# EAGLE design uv5rAdaptor (EAGLE 6.2)
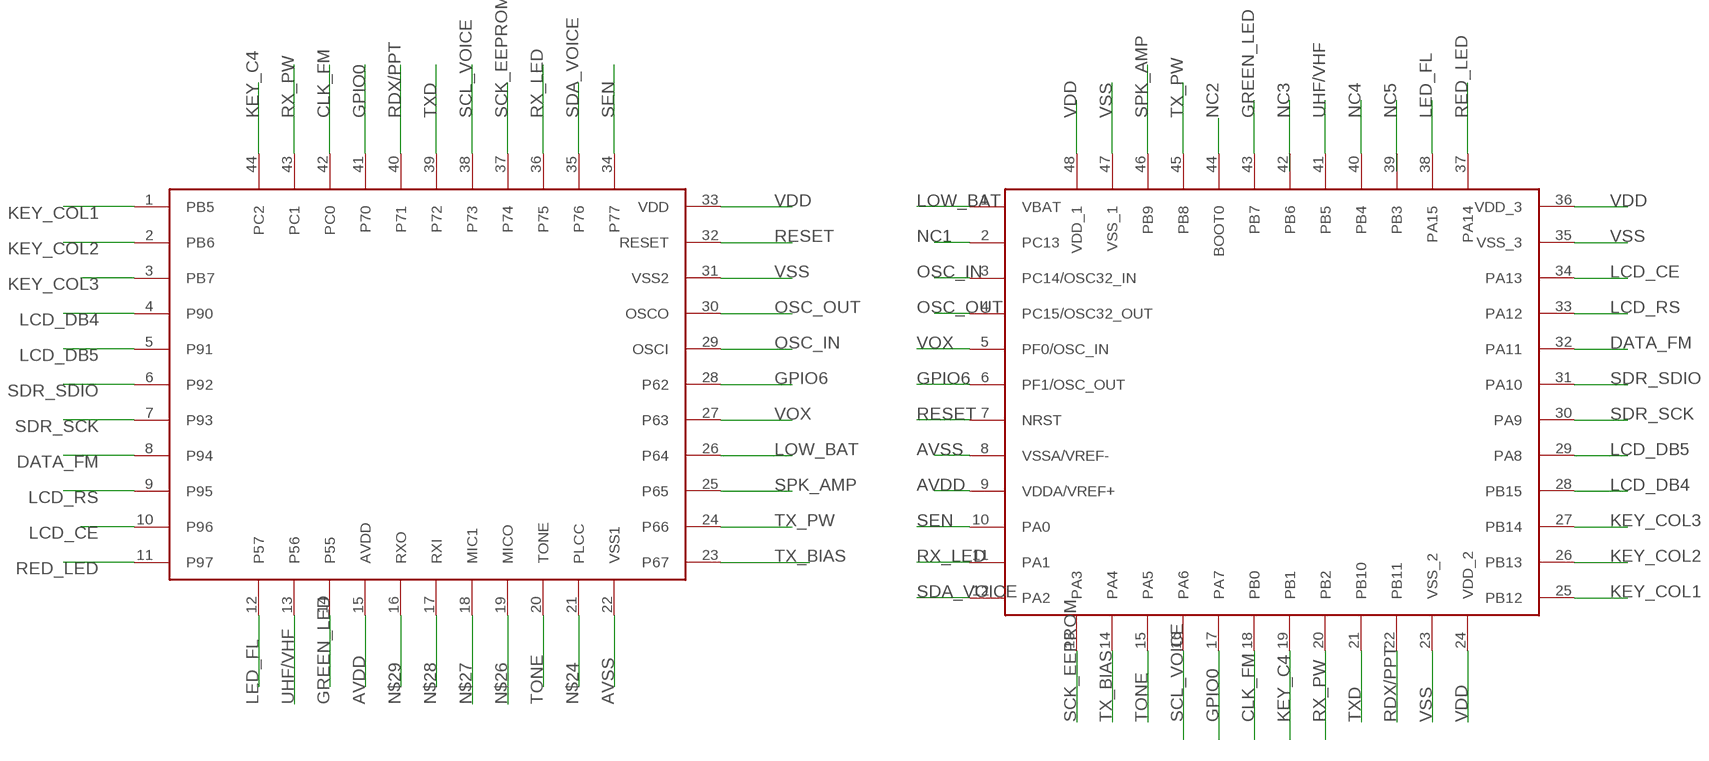
[diagram p0: schematic, sheet 1]

## Parts
U$1  STM32F302XX/STM32F303XX  [LQFP48]
U$2  UV5R  [TQFP44]

## Nets
AVDD: U$1.9(VDDA/VREF+) U$2.15(AVDD)
AVSS: U$1.8(VSSA/VREF-) U$2.22(VSS1)
CLK_FM: U$1.18(PB0) U$2.42(PC0)
DATA_FM: U$1.32(PA11) U$2.8(P94)
GPIO0: U$1.17(PA7) U$2.41(P70)
GPIO6: U$1.6(PF1/OSC_OUT) U$2.28(P62)
GREEN_LED: U$1.43(PB7) U$2.14(P55)
KEY_C4: U$1.19(PB1) U$2.44(PC2)
KEY_COL1: U$1.25(PB12) U$2.1(PB5)
KEY_COL2: U$1.26(PB13) U$2.2(PB6)
KEY_COL3: U$1.27(PB14) U$2.3(PB7)
LCD_CE: U$1.34(PA13) U$2.10(P96)
LCD_DB4: U$1.28(PB15) U$2.4(P90)
LCD_DB5: U$1.29(PA8) U$2.5(P91)
LCD_RS: U$1.33(PA12) U$2.9(P95)
LED_FL: U$1.38(PA15) U$2.12(P57)
LOW_BAT: U$1.1(VBAT) U$2.26(P64)
N$24: U$2.21(PLCC)
N$26: U$2.19(MICO)
N$27: U$2.18(MIC1)
N$28: U$2.17(RXI)
N$29: U$2.16(RXO)
NC1: U$1.2(PC13)
NC2: U$1.44(BOOT0)
NC4: U$1.40(PB4)
OSC_IN: U$1.3(PC14/OSC32_IN) U$2.29(OSCI)
OSC_OUT: U$1.4(PC15/OSC32_OUT) U$2.30(OSCO)
RDX/PPT: U$1.22(PB11) U$2.40(P71)
RED_LED: U$1.37(PA14) U$2.11(P97)
RESET: U$1.7(NRST) U$2.32(RESET)
RX_LED: U$1.11(PA1) U$2.36(P75)
RX_PW: U$1.20(PB2) U$2.43(PC1)
SCK_EEPROM: U$1.13(PA3) U$2.37(P74)
SCL_VOICE: U$1.16(PA6) U$2.38(P73)
SDA_VOICE: U$1.12(PA2) U$2.35(P76)
SDR_SCK: U$1.30(PA9) U$2.7(P93)
SDR_SDIO: U$1.31(PA10) U$2.6(P92)
SEN: U$1.10(PA0) U$2.34(P77)
SPK_AMP: U$1.46(PB9) U$2.25(P65)
TONE: U$1.15(PA5) U$2.20(TONE)
TX_BIAS: U$1.14(PA4) U$2.23(P67)
TX_PW: U$1.45(PB8) U$2.24(P66)
TXD: U$1.21(PB10) U$2.39(P72)
UHF/VHF: U$1.41(PB5) U$2.13(P56)
VDD: U$1.24(VDD_2) U$1.36(VDD_3) U$1.48(VDD_1) U$2.33(VDD)
VOX: U$1.5(PF0/OSC_IN) U$2.27(P63)
VSS: U$1.23(VSS_2) U$1.35(VSS_3) U$1.47(VSS_1) U$2.31(VSS2)
Unconnected: U$1.39(PB3) U$1.42(PB6)

## Library data of the parts
U$1 = Stm:STM32F302XX/STM32F303XX
U$2 = Stm:UV5R

## Board
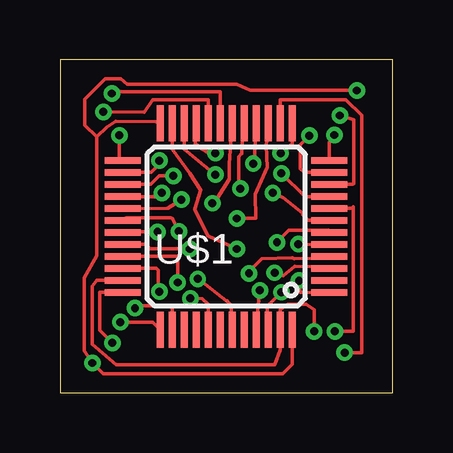
[diagram p1: board, top side]
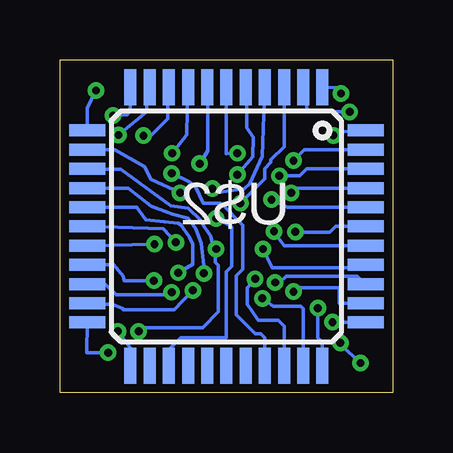
[diagram p2: board, bottom side, seen from below]

Size 13.87 x 13.87 mm. Coordinates in mm from the lower left corner, seen from the top.
Outline: 0,0 13.87,0 13.87,13.87 0,13.87 0,0
Copper layers (1*16): Top 0.0356mm / dielectric 1.5011mm / Bottom 0.0356mm
Design rules: minimum track width 6mil, minimum drill 13mil, track to track 6mil, track to pad 6mil, pad to pad 6mil, via to via 6mil, smd to smd 6mil, copper to edge 15mil, drill to drill 6mil, minimum pad ring 7mil, minimum via ring 7mil, stop-mask expansion 4mil, vias tented up to drill 0mil, thermal gap 10mil

### Footprints (pad centres in the part's own frame; a part is rotated, then mirrored left to right if it is on the bottom)
LQFP48 = smd 1.5 x 0.28: 1 -4.3,2.75; 2 -4.3,2.25; 3 -4.3,1.75; 4 -4.3,1.25; 5 -4.3,0.75; 6 -4.3,0.25; 7 -4.3,-0.25; 8 -4.3,-0.75; 9 -4.3,-1.25; 10 -4.3,-1.75; 11 -4.3,-2.25; 12 -4.3,-2.75; 25 4.3,-2.75; 26 4.3,-2.25; 27 4.3,-1.75; 28 4.3,-1.25; 29 4.3,-0.75; 30 4.3,-0.25; 31 4.3,0.25; 32 4.3,0.75; 33 4.3,1.25; 34 4.3,1.75; 35 4.3,2.25; 36 4.3,2.75 | smd 0.28 x 1.5: 13 -2.75,-4.3; 14 -2.25,-4.3; 15 -1.75,-4.3; 16 -1.25,-4.3; 17 -0.75,-4.3; 18 -0.25,-4.3; 19 0.25,-4.3; 20 0.75,-4.3; 21 1.25,-4.3; 22 1.75,-4.3; 23 2.25,-4.3; 24 2.75,-4.3; 37 2.75,4.3; 38 2.25,4.3; 39 1.75,4.3; 40 1.25,4.3; 41 0.75,4.3; 42 0.25,4.3; 43 -0.25,4.3; 44 -0.75,4.3; 45 -1.25,4.3; 46 -1.75,4.3; 47 -2.25,4.3; 48 -2.75,4.3
TQFP44 = smd 1.5 x 0.5 bottom: 1 -5.8,4; 2 -5.8,3.2; 3 -5.8,2.4; 4 -5.8,1.6; 5 -5.8,0.8; 6 -5.8,0; 7 -5.8,-0.8; 8 -5.8,-1.6; 9 -5.8,-2.4; 10 -5.8,-3.2; 11 -5.8,-4; 23 5.8,-4; 24 5.8,-3.2; 25 5.8,-2.4; 26 5.8,-1.6; 27 5.8,-0.8; 28 5.8,0; 29 5.8,0.8; 30 5.8,1.6; 31 5.8,2.4; 32 5.8,3.2; 33 5.8,4 | smd 0.5 x 1.5 bottom: 12 -4,-5.8; 13 -3.2,-5.8; 14 -2.4,-5.8; 15 -1.6,-5.8; 16 -0.8,-5.8; 17 0,-5.8; 18 0.8,-5.8; 19 1.6,-5.8; 20 2.4,-5.8; 21 3.2,-5.8; 22 4,-5.8; 34 4,5.8; 35 3.2,5.8; 36 2.4,5.8; 37 1.6,5.8; 38 0.8,5.8; 39 0,5.8; 40 -0.8,5.8; 41 -1.6,5.8; 42 -2.4,5.8; 43 -3.2,5.8; 44 -4,5.8

### Placement (x,y rotation side)
U$1  6.92,6.93 180 top
U$2  6.93,6.93 0 top

### Tracks (layer width: path | path; a pad name or v marks a point on that pad's centre or on a via)
AVDD  (via drill 0.33 pad 0.18)
  Top 0.152: v9.22,9.14 10.21,8.18 U$1.9
  Bottom 0.152: U$2.15 5.33,1.65 | v9.22,9.14 8.48,8.79 8.23,8.61 7.9,7.9 7.19,7.9 7.16,7.87 7.11,7.85 6.25,6.98 6.25,5.16 6.53,4.88 6.53,3.25 5.74,2.46 5.51,2.46 5.33,2.29 5.33,1.65 | 5.33,1.65
AVSS  (via drill 0.33 pad 0.18)
  Top 0.152: U$1.8 12.13,7.68 12.22,7.75 12.22,2.57 v11.46,2.57
  Bottom 0.152: v11.46,2.57 10.94,1.88 U$2.22
CLK_FM  (via drill 0.33 pad 0.18)
  Top 0.152: U$1.18 7.05,9.54 7.06,8.89 6.55,8.1 v6.35,7.9
  Bottom 0.152: U$2.42 4.53,10.25 5.08,9.7 5.08,9.6 5.33,9.35 5.33,8.92 v6.35,7.9
DATA_FM  (via drill 0.33 pad 0.18)
  Top 0.152: U$1.32 3.62,6.18 3.71,5.99 v5.41,5.99
  Bottom 0.152: v5.41,5.99 5.03,5.21 1.13,5.21 U$2.8
GPIO0  (via drill 0.33 pad 0.18)
  Top 0.152: U$1.17 7.62,10.91 7.57,10.13 7.57,9.96 7.54,9.96 7.44,9.83 7.44,8.61 v7.52,8.51
  Bottom 0.152: v7.52,8.51 7.21,8.36 6.2,8.51 5.97,8.71 5.44,9.85 U$2.41
GPIO6  (via drill 0.33)
  Top 0.152: v9.04,6.27 9.53,6.78 11.2,6.78 11.2,6.68 U$1.6
  Bottom 0.152: U$2.28 9.58,6.83 v9.04,6.27
GREEN_LED  (via drill 0.33 pad 0.18)
  Top 0.152: v5.74,4.75 5.77,4.75 7.04,3.76 | 6.96,3.84 7.04,3.76 | 7.04,3.76 7.14,3.66 7.16,2.65 U$1.43
  Bottom 0.152: U$2.14 4.53,2.78 4.78,3.02 5.61,3.02 6.07,3.68 6.07,4.37 v5.74,4.75
KEY_C4  (via drill 0.33 pad 0.18)
  Top 0.152: U$1.19 6.67,12.54 6.68,12.55 2.51,12.55 2.29,12.42 v2.16,12.47
  Bottom 0.152: v2.16,12.47 2.16,12.72 U$2.44
KEY_COL1  (via drill 0.33 pad 0.18)
  Top 0.152: v2.48,10.73 2.48,9.69 U$1.25
  Bottom 0.152: U$2.1 2.05,10.88 v2.48,10.73
KEY_COL2  (via drill 0.33 pad 0.18)
  Top 0.152: v4.14,9.68 4.14,9.52 3.81,9.19 U$1.26
  Bottom 0.152: U$2.2 3.68,10.13 v4.14,9.68
KEY_COL3  (via drill 0.33 pad 0.18)
  Top 0.152: 4.75,9.04 v4.72,9.04 4.14,9.04 3.78,8.69 U$1.27
  Bottom 0.152: U$2.3 3.59,9.33 3.89,9.04 v4.72,9.04
LCD_CE  (via drill 0.33 pad 0.18)
  Top 0.152: v4.14,4.22 4.09,4.29 4.09,5.11 4.01,5.18 U$1.34
  Bottom 0.152: U$2.10 2.24,3.73 2.24,4.37 3.84,4.37 v4.14,4.22
LCD_DB4  (via drill 0.33 pad 0.18)
  Top 0.152: v4.24,8.33 4.14,8.33 3.99,8.18 U$1.28
  Bottom 0.152: U$2.4 4.09,8.53 | 4.09,8.53 v4.24,8.33 4.09,8.48 4.09,8.53
LCD_DB5  (via drill 0.33 pad 0.18)
  Top 0.152: v5.05,8.05 4.5,7.7 2.64,7.67 U$1.29
  Bottom 0.152: U$2.5 4.41,7.73 v5.05,8.05
LCD_RS  (via drill 0.33 pad 0.18)
  Top 0.152: U$1.33 4.88,5.68 4.9,5.66 v4.9,4.6
  Bottom 0.152: 1.27,4.67 U$2.9 1.48,4.85 4.45,4.85 4.72,4.6 v4.9,4.6
LED_FL  (via drill 0.33 pad 0.18)
  Top 0.152: U$1.38 4.67,3.63 4.62,3.63 3.18,3.63 v3.12,3.53
  Bottom 0.152: v3.12,3.53 3.12,2.29 2.95,2.13 2.95,1.15 U$2.12
LOW_BAT  (via drill 0.33 pad 0.18)
  Top 0.152: v9.96,4.67 10.01,4.19 11.21,4.17 U$1.1
  Bottom 0.152: U$2.26 11.63,5.33 11.23,4.85 11.2,4.67 v9.96,4.67
NC1
  Top 0.152: 11.21,4.67 U$1.2
OSC_IN  (via drill 0.33)
  Top 0.152: v8.94,5 9.3,4.88 9.78,5.28 11.22,5.26 U$1.3
  Bottom 0.152: U$2.29 10.68,7.73 10.29,7.21 9.53,7.14 8.94,7.06 8.84,7.01 8.48,6.5 8.33,6.2 8.33,5.36 v8.94,5
OSC_OUT  (via drill 0.33)
  Top 0.152: v7.87,4.98 8.08,5.26 8.41,5.59 9.68,5.64 9.75,5.59 10.72,5.61 10.72,5.69 11.02,5.69 U$1.4
  Bottom 0.152: U$2.30 11.02,8.53 10.06,7.77 9.17,7.44 8.53,7.26 8.2,6.83 7.98,6.22 7.87,5.31 v7.87,4.98
RDX/PPT  (via drill 0.33 pad 0.18)
  Top 0.152: U$1.22 5.17,10.14 v6.48,9.09
  Bottom 0.152: v6.48,9.09 5.84,9.83 5.82,10.64 6.1,11.05 6.1,12.7 U$2.40
RED_LED  (via drill 0.33 pad 0.18)
  Top 0.152: v2.51,2.95 3.86,2.95 U$1.37
  Bottom 0.152: U$2.11 2.5,2.93 v2.51,2.95
RESET  (via drill 0.33 pad 0.18)
  Top 0.152: v8.86,8.33 9.3,8.13 10.11,7.49 10.11,7.42 10.34,7.19 U$1.7
  Bottom 0.152: U$2.32 11.58,10.13 10.34,9.42 10.08,8.89 v8.86,8.33
RX_LED  (via drill 0.33 pad 0.18)
  Top 0.152: U$1.11 10.17,9.18 10.01,9.35 10.01,10.34 v10.39,10.72
  Bottom 0.152: v10.39,10.72 10.08,10.72 9.37,11.43 9.37,12.7 U$2.36
RX_PW  (via drill 0.33 pad 0.18)
  Top 0.152: U$1.20 6.17,12.19 6.17,12.22 3.86,12.22 3.51,11.68 v1.8,11.71
  Bottom 0.152: v1.8,11.71 3.58,11.71 3.58,12.56 U$2.43
SCK_EEPROM  (via drill 0.33 pad 0.18)
  Top 0.152: U$1.13 9.67,10.39 v9.19,9.98
  Bottom 0.152: v9.19,9.98 8.59,10.74 8.56,11.76 8.56,12.71 U$2.37
SCL_VOICE  (via drill 0.33 pad 0.18)
  Top 0.152: U$1.16 8.1,9.66 v8.05,9.55
  Bottom 0.152: v8.05,9.55 8,9.6 7.72,10.08 7.72,12.72 U$2.38
SDA_VOICE  (via drill 0.33 pad 0.18)
  Top 0.152: U$1.12 11.22,10.44 v11.43,10.74
  Bottom 0.152: v11.43,10.74 10.26,11.71 10.26,12.61 U$2.35
SDR_SCK  (via drill 0.33 pad 0.18)
  Top 0.152: v4.95,6.73 4.7,7.23 4.7,7.26 4.62,7.29 2.78,7.29 U$1.30
  Bottom 0.152: v4.95,6.73 4.95,6.71 4.52,6.12 1.15,6.12 U$2.7
SDR_SDIO  (via drill 0.33 pad 0.18)
  Top 0.152: v4.06,6.71 2.65,6.71 U$1.31
  Bottom 0.152: U$2.6 2.37,6.93 U$1.31 4.04,6.68 v4.06,6.71
SEN  (via drill 0.33 pad 0.18)
  Top 0.152: U$1.10 12.19,8.68 12.24,8.71 12.24,11.38 v11.66,11.56
  Bottom 0.152: U$2.34 10.93,11.95 10.95,11.84 11.07,11.58 v11.66,11.56
SPK_AMP  (via drill 0.33 pad 0.18)
  Top 0.152: v9.22,4.19 8.64,3.61 8.64,2.67 U$1.46
  Bottom 0.152: U$2.25 11.98,4.53 11.53,4.09 9.5,4.09 v9.22,4.19
TONE  (via drill 0.33 pad 0.18)
  Top 0.152: U$1.15 8.69,11.22 8.59,10.29 8.64,9.4 8.13,8.28 8.15,7.26 v7.37,7.26
  Bottom 0.152: U$2.20 9.33,1.79 8.84,2.29 6.93,2.29 6.93,5.05 6.71,5.28 6.71,6.91 6.76,6.96 v7.37,7.26
TX_BIAS  (via drill 0.33 pad 0.18)
  Top 0.152: U$1.14 9.17,11.48 9.17,12.22 11.91,12.22 12.57,11.56 12.57,1.68 v11.86,1.68
  Bottom 0.152: v11.86,1.68 12.75,1.67 U$2.23
TX_PW  (via drill 0.33 pad 0.18)
  Top 0.152: v8.33,4.27 8.15,2.65 U$1.45
  Bottom 0.152: U$2.24 12.68,3.68 11.68,3.68 11.23,3.51 11.23,3.45 9.12,3.45 v8.33,4.27
TXD  (via drill 0.33 pad 0.18)
  Top 0.152: v6.48,9.98 6.4,9.86 5.64,10.36 U$1.21
  Bottom 0.152: U$2.39 6.93,9.96 v6.48,9.98
UHF/VHF  (via drill 0.33 pad 0.18)
  Top 0.152: v5.44,3.94 5.92,3.91 6.17,3.68 U$1.41
  Bottom 0.152: U$2.13 3.73,3.51 3.84,3.61 4.98,3.61 v5.44,3.94
VDD  (via drill 0.33 pad 0.18)
  Top 0.152: U$1.48 9.67,1.19 9.27,0.79 1.8,0.79 v1.35,1.24 1.02,1.75 1.02,4.8 1.52,5.71 1.52,10.67 | U$1.36 1.65,4.19 1.65,2.62 v2.18,2.08 | U$1.24 4.11,11.3 3.99,11.3 2.32,11.31 1.94,11.07 1.52,10.67 | v12.37,12.6 7.92,12.6 7.37,12.85 2.79,12.85 2.54,13.08 1.88,13.08 1.04,12.24 1.04,11.15 1.52,10.67
  Bottom 0.152: U$2.33 12.73,11.85 v12.37,12.6 | v2.18,2.08 2.18,2.01 v1.35,1.24
VOX  (via drill 0.33)
  Top 0.152: v9.93,6.2 11.19,6.15 U$1.5
  Bottom 0.152: U$2.27 9.92,6.18 v9.93,6.2
VSS  (via drill 0.33 pad 0.18)
  Top 0.152: U$1.23 4.67,10.16 5.41,9.14 5.87,8.43 5.87,8.46 5.61,7.65 6.15,6.55 6.2,6.53 v7.37,5.99 | v10.59,2.57 10.59,3.45 10.26,3.68 9.5,3.68 9.17,3.45 U$1.47 9.17,1.8 8.94,1.17 2.34,1.17 1.35,2.03 1.35,4.44 1.53,4.68 U$1.35
  Bottom 0.152: 10.52,2.63 v10.59,2.57 10.44,2.72 7.92,2.72 7.26,3.38 7.26,5.31 7.39,5.44 7.39,5.99 v7.37,5.99 7.39,5.94 7.44,5.92 7.59,6.53 7.98,7.11 8,7.19 8.53,7.7 9.25,7.8 11.33,9.32 12.72,9.32 U$2.31